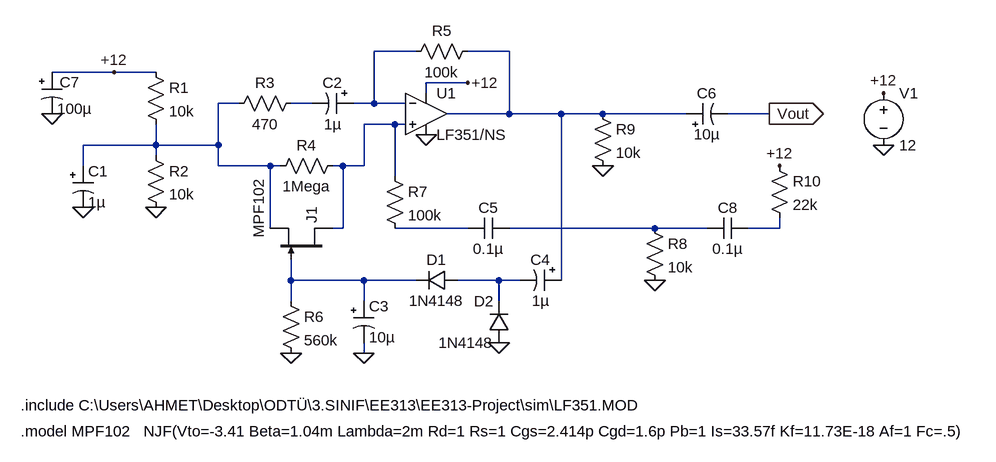
[diagram p0: schematic agc_jfet.asc]
agc_jfet.asc, the LTspice schematic file:
Version 4
SHEET 1 2180 680
WIRE 384 0 320 0
WIRE 528 0 464 0
WIRE -80 32 -176 32
WIRE -16 32 -80 32
WIRE 464 48 400 48
WIRE 400 64 400 48
WIRE 112 80 80 80
WIRE 224 80 192 80
WIRE 320 80 320 0
WIRE 320 80 288 80
WIRE 368 80 320 80
WIRE 528 96 528 0
WIRE 528 96 432 96
WIRE 608 96 528 96
WIRE 672 96 608 96
WIRE 800 96 672 96
WIRE 928 96 864 96
WIRE 352 112 304 112
WIRE 368 112 352 112
WIRE -16 144 -16 112
WIRE -16 144 -128 144
WIRE 80 144 80 80
WIRE 80 144 -16 144
WIRE -16 160 -16 144
WIRE -128 176 -128 144
WIRE 80 176 80 144
WIRE 160 176 80 176
WIRE 176 176 160 176
WIRE 272 176 256 176
WIRE 304 176 304 112
WIRE 304 176 272 176
WIRE 352 192 352 112
WIRE 160 272 160 176
WIRE 272 272 272 176
WIRE 272 272 256 272
WIRE 464 272 352 272
WIRE 752 272 528 272
WIRE 832 272 752 272
WIRE 944 272 944 256
WIRE 944 272 896 272
WIRE 192 352 192 320
WIRE 304 352 192 352
WIRE 384 352 304 352
WIRE 512 352 448 352
WIRE 544 352 512 352
WIRE 608 352 608 96
WIRE 192 384 192 352
WIRE 304 384 304 352
WIRE 512 384 512 352
WIRE 304 464 304 448
FLAG -16 240 0
FLAG -128 240 0
FLAG 192 464 0
FLAG 304 464 0
FLAG 512 448 0
FLAG 752 352 0
FLAG 672 176 0
FLAG 400 128 0
FLAG 464 48 +12
FLAG 1104 144 0
FLAG 1104 64 +12
FLAG -176 96 0
FLAG -80 32 +12
FLAG 928 96 Vout
IOPIN 928 96 Out
FLAG 944 176 +12
SYMBOL res -32 16 R0
SYMATTR InstName R1
SYMATTR Value 10k
SYMBOL res -32 144 R0
SYMATTR InstName R2
SYMATTR Value 10k
SYMBOL polcap -144 176 R0
SYMATTR InstName C1
SYMATTR Value 1µ
SYMATTR SpiceLine V=16
SYMBOL res 208 64 R90
WINDOW 0 0 56 VBottom 2
WINDOW 3 32 56 VTop 2
SYMATTR InstName R3
SYMATTR Value 470
SYMBOL res 272 160 R90
WINDOW 0 0 56 VBottom 2
WINDOW 3 32 56 VTop 2
SYMATTR InstName R4
SYMATTR Value 1Mega
SYMBOL polcap 288 64 R90
WINDOW 0 0 32 VBottom 2
WINDOW 3 32 32 VTop 2
SYMATTR InstName C2
SYMATTR Value 1µ
SYMATTR SpiceLine V=16
SYMBOL res 480 -16 R90
WINDOW 0 0 56 VBottom 2
WINDOW 3 32 56 VTop 2
SYMATTR InstName R5
SYMATTR Value 100k
SYMBOL njf 256 320 M270
WINDOW 3 33 114 Left 2
SYMATTR Value MPF102
SYMATTR InstName J1
SYMBOL res 176 368 R0
SYMATTR InstName R6
SYMATTR Value 560k
SYMBOL polcap 288 384 R0
SYMATTR InstName C3
SYMATTR Value 10µ
SYMATTR SpiceLine V=16
SYMBOL diode 448 336 R90
WINDOW 0 0 32 VBottom 2
WINDOW 3 32 32 VTop 2
SYMATTR InstName D1
SYMATTR Value 1N4148
SYMBOL diode 528 448 R180
WINDOW 0 24 64 Left 2
WINDOW 3 24 0 Left 2
SYMATTR InstName D2
SYMATTR Value 1N4148
SYMBOL polcap 608 336 R90
WINDOW 0 0 32 VBottom 2
WINDOW 3 32 32 VTop 2
SYMATTR InstName C4
SYMATTR Value 1µ
SYMATTR SpiceLine V=16
SYMBOL res 336 176 R0
SYMATTR InstName R7
SYMATTR Value 100k
SYMBOL res 736 256 R0
SYMATTR InstName R8
SYMATTR Value 10k
SYMBOL res 656 80 R0
SYMATTR InstName R9
SYMATTR Value 10k
SYMBOL polcap 800 112 R270
WINDOW 0 32 32 VTop 2
WINDOW 3 0 32 VBottom 2
SYMATTR InstName C6
SYMATTR Value 10µ
SYMATTR SpiceLine V=16
SYMBOL cap 528 256 R90
WINDOW 0 0 32 VBottom 2
WINDOW 3 32 32 VTop 2
SYMATTR InstName C5
SYMATTR Value 0.1µ
SYMBOL voltage 1104 48 R0
WINDOW 123 0 0 Left 0
WINDOW 39 0 0 Left 0
SYMATTR InstName V1
SYMATTR Value 12
SYMBOL polcap -192 32 R0
WINDOW 0 28 15 Left 2
SYMATTR InstName C7
SYMATTR Value 100µ
SYMATTR SpiceLine V=16
SYMBOL OpAmps\\opamp2 400 32 R0
SYMATTR InstName U1
SYMATTR Value LF351/NS
SYMBOL res 928 160 R0
SYMATTR InstName R10
SYMATTR Value 22k
SYMBOL cap 896 256 R90
WINDOW 0 0 32 VBottom 2
WINDOW 3 32 32 VTop 2
SYMATTR InstName C8
SYMATTR Value 0.1µ
TEXT -224 584 Left 2 !.model MPF102   NJF(Vto=-3.41 Beta=1.04m Lambda=2m Rd=1 Rs=1 Cgs=2.414p Cgd=1.6p Pb=1 Is=33.57f Kf=11.73E-18 Af=1 Fc=.5)
TEXT -224 544 Left 2 !.include C:\\Users\\AHMET\\Desktop\\ODTÜ\\3.SINIF\\EE313\\EE313-Project\\sim\\LF351.MOD

The netlist it stands for:
* agc_jfet.asc
R1 +12 N003 10k
R2 N003 0 10k
C1 N003 0 1µ V=16
R3 N004 N003 470
R4 N005 N003 1Mega
C2 N001 N004 1µ V=16
R5 N002 N001 100k
J1 N005 N009 N003 MPF102
R6 N009 0 560k
C3 N009 0 10µ V=16
D1 N010 N009 1N4148
D2 0 N010 1N4148
C4 N002 N010 1µ V=16
R7 N005 N006 100k
R8 N007 0 10k
R9 N002 0 10k
C6 N002 Vout 10µ V=16
C5 N007 N006 0.1µ
V1 +12 0 12
C7 +12 0 100µ V=16
XU1 N005 N001 +12 0 N002 LF351/NS  ; pins In+ In- V+ V- OUT
R10 +12 N008 22k
C8 N008 N007 0.1µ
.model D D
.lib standard.dio
.model NJF NJF
.model PJF PJF
.lib standard.jft
.model MPF102   NJF(Vto=-3.41 Beta=1.04m Lambda=2m Rd=1 Rs=1 Cgs=2.414p Cgd=1.6p Pb=1 Is=33.57f Kf=11.73E-18 Af=1 Fc=.5)
.include C:\Users\AHMET\Desktop\ODTÜ\3.SINIF\EE313\EE313-Project\sim\LF351.MOD
.backanno
.end